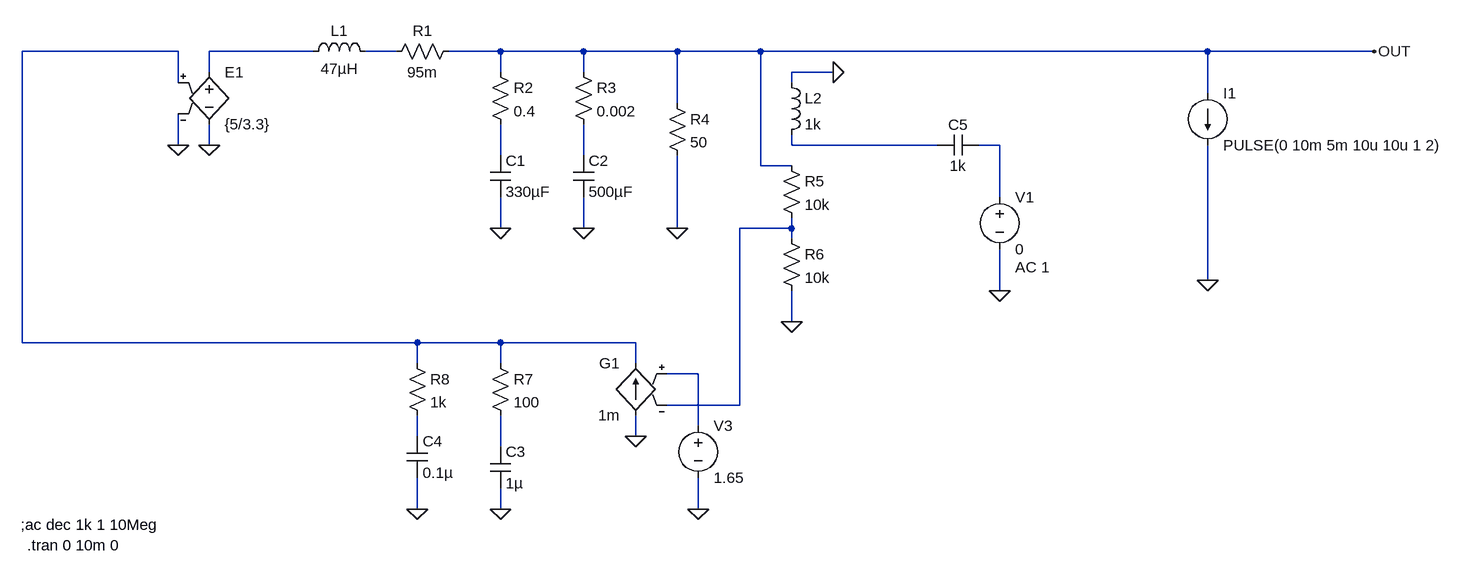
[diagram p0: schematic Draft1.asc]
Draft1.asc, the LTspice schematic file:
Version 4
SHEET 1 2016 904
WIRE 48 128 -192 128
WIRE 256 128 96 128
WIRE 384 128 336 128
WIRE 544 128 464 128
WIRE 672 128 544 128
WIRE 816 128 672 128
WIRE 944 128 816 128
WIRE 1632 128 944 128
WIRE 1888 128 1632 128
WIRE 96 160 96 128
WIRE 544 160 544 128
WIRE 672 160 672 128
WIRE 1056 160 992 160
WIRE 48 176 48 128
WIRE 992 176 992 160
WIRE 1632 192 1632 128
WIRE 816 208 816 128
WIRE 48 272 48 224
WIRE 96 272 96 240
WIRE 992 272 992 256
WIRE 1216 272 992 272
WIRE 1312 272 1280 272
WIRE 544 288 544 240
WIRE 672 288 672 240
WIRE 944 304 944 128
WIRE 992 304 944 304
WIRE 1312 352 1312 272
WIRE 544 400 544 352
WIRE 672 400 672 352
WIRE 816 400 816 288
WIRE 992 400 992 384
WIRE 992 400 912 400
WIRE 992 416 992 400
WIRE 1632 480 1632 272
WIRE 1312 496 1312 432
WIRE 992 544 992 496
WIRE -192 576 -192 128
WIRE 416 576 -192 576
WIRE 544 576 416 576
WIRE 752 576 544 576
WIRE 416 608 416 576
WIRE 544 608 544 576
WIRE 752 608 752 576
WIRE 848 624 800 624
WIRE 912 672 912 400
WIRE 912 672 800 672
WIRE 848 704 848 624
WIRE 416 720 416 688
WIRE 752 720 752 688
WIRE 544 736 544 688
WIRE 416 832 416 784
WIRE 544 832 544 800
WIRE 848 832 848 784
FLAG 544 400 0
FLAG 672 400 0
FLAG 816 400 0
FLAG 1888 128 OUT
FLAG 992 544 0
FLAG 752 720 0
FLAG 544 832 0
FLAG 416 832 0
FLAG 96 272 0
FLAG 48 272 0
FLAG 1312 496 0
FLAG 848 832 0
FLAG 1056 160 0
FLAG 1632 480 0
SYMBOL ind 240 144 R270
WINDOW 0 32 56 VTop 2
WINDOW 3 5 56 VBottom 2
SYMATTR InstName L1
SYMATTR Value 47µH
SYMBOL res 480 112 R90
WINDOW 0 0 56 VBottom 2
WINDOW 3 32 56 VTop 2
SYMATTR InstName R1
SYMATTR Value 95m
SYMBOL cap 528 288 R0
SYMATTR InstName C1
SYMATTR Value 330µF
SYMBOL res 528 144 R0
SYMATTR InstName R2
SYMATTR Value 0.4
SYMBOL cap 656 288 R0
SYMATTR InstName C2
SYMATTR Value 500µF
SYMBOL res 656 144 R0
SYMATTR InstName R3
SYMATTR Value 0.002
SYMBOL res 800 192 R0
SYMATTR InstName R4
SYMATTR Value 50
SYMBOL res 976 288 R0
SYMATTR InstName R5
SYMATTR Value 10k
SYMBOL res 976 400 R0
SYMATTR InstName R6
SYMATTR Value 10k
SYMBOL g 752 592 M0
SYMATTR InstName G1
SYMATTR Value 1m
SYMBOL cap 528 736 R0
SYMATTR InstName C3
SYMATTR Value 1µ
SYMBOL res 528 592 R0
SYMATTR InstName R7
SYMATTR Value 100
SYMBOL res 400 592 R0
SYMATTR InstName R8
SYMATTR Value 1k
SYMBOL cap 400 720 R0
SYMATTR InstName C4
SYMATTR Value 0.1µ
SYMBOL e 96 144 R0
SYMATTR InstName E1
SYMATTR Value {5/3.3}
SYMBOL ind 976 160 R0
SYMATTR InstName L2
SYMATTR Value 1k
SYMBOL cap 1280 256 R90
WINDOW 0 0 32 VBottom 2
WINDOW 3 32 32 VTop 2
SYMATTR InstName C5
SYMATTR Value 1k
SYMBOL voltage 1312 336 R0
WINDOW 123 24 124 Left 2
WINDOW 39 0 0 Left 0
SYMATTR InstName V1
SYMATTR Value 0
SYMATTR Value2 AC 1
SYMBOL voltage 848 688 R0
WINDOW 123 0 0 Left 0
WINDOW 39 0 0 Left 0
SYMATTR InstName V3
SYMATTR Value 1.65
SYMBOL current 1632 192 R0
WINDOW 123 0 0 Left 0
WINDOW 39 0 0 Left 0
SYMATTR InstName I1
SYMATTR Value PULSE(0 10m 5m 10u 10u 1 2)
TEXT -194 856 Left 2 !;ac dec 1k 1 10Meg
TEXT -184 888 Left 2 !.tran 0 10m 0

The netlist it stands for:
* Draft1.asc
L1 N002 N003 47µH
R1 OUT N003 95m
C1 N006 0 330µF
R2 OUT N006 0.4
C2 N007 0 500µF
R3 OUT N007 0.002
R4 OUT 0 50
R5 OUT N008 10k
R6 N008 0 10k
G1 0 N001 N009 N008 1m
C3 N011 0 1µ
R7 N001 N011 100
R8 N001 N010 1k
C4 N010 0 0.1µ
E1 N002 0 N001 0 {5/3.3}
L2 0 N004 1k
C5 N005 N004 1k
V1 N005 0 0 AC 1
V3 N009 0 1.65
I1 OUT 0 PULSE(0 10m 5m 10u 10u 1 2)
;ac dec 1k 1 10Meg
.tran 0 10m 0
.backanno
.end